# EAGLE design SJPL1 (EAGLE 7.7.0)
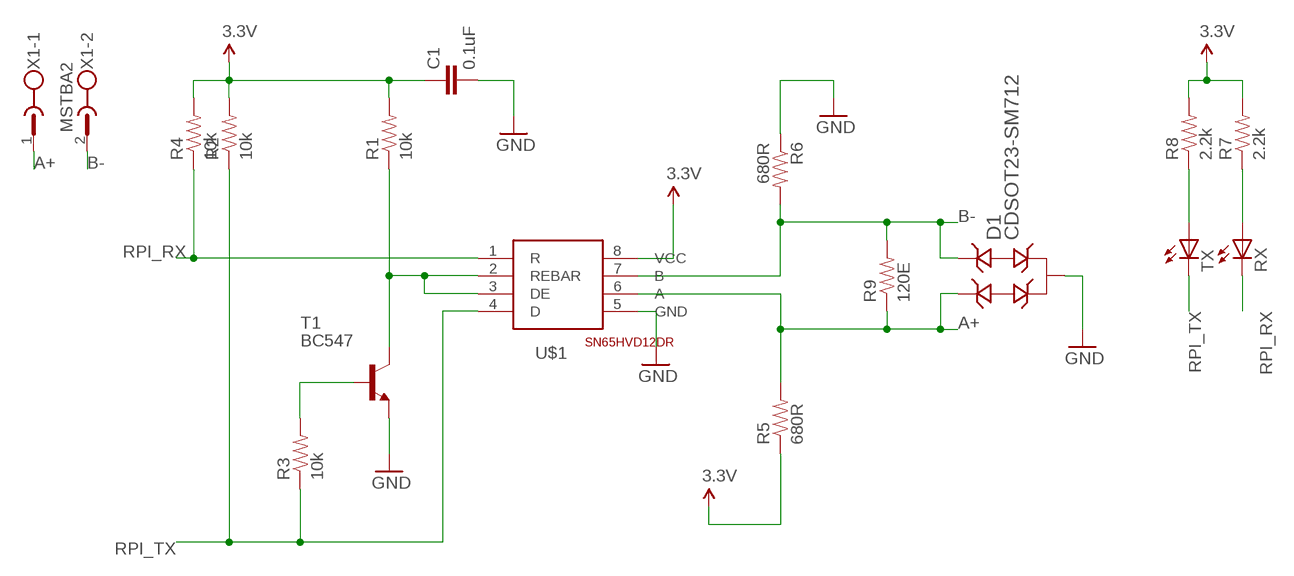
[diagram p0: schematic, sheet 1]

## Parts
C1  0.1uF  CAP0402-CAP  [0402-CAP]
D1  CDSOT23-SM712  [SOT-23-3]
R1  10k  RESISTOR0402  [0402-RES]
R2  10k  RESISTOR0402  [0402-RES]
R3  10k  RESISTOR0402  [0402-RES]
R4  10k  RESISTOR0402  [0402-RES]
R5  680R  RESISTOR0402  [0402-RES]
R6  680R  RESISTOR0402  [0402-RES]
R7  2.2k  RESISTOR0402  [0402-RES]
R8  2.2k  RESISTOR0402  [0402-RES]
R9  120E  RESISTOR0402  [0402-RES]
RX  LED5MM  [LED5MM]
T1  BC547  [TO92]
TX  LED5MM  [LED5MM]
U$1  MODBUS-DIP8MODBUSSO  [MODBUSS0]
X1  MSTBA2  [MSTBA2]

## Nets
A+: D1.1(IO1) R5.2 R9.1 X1.1
B-: D1.2(IO2) R6.2 R9.2 X1.2
GND: C1.2 D1.3(GND) R6.1
N$1: R8.1 TX.A
N$2: R7.1 RX.A
N$3: T1.1(E) ; supply symbol labelled GND
N$4: R1.1 T1.3(C) U$1.2(REBAR) U$1.3(DE)
N$5: R3.2 T1.2(B)
RPI_RX: R4.1 RX.K(C) U$1.1(R)
RPI_TX: R2.1 R3.1 TX.K(C) U$1.4(D)
VCC: C1.1 R1.2 R2.2 R4.2 R5.1 R7.2 R8.2 ; supply symbol labelled 3.3V
Unconnected: U$1.5(GND) U$1.6(A) U$1.7(B) U$1.8(VCC)

## Library data of the parts
C1 = SparkFun-Passives:CAP: Capacitor Standard 0603 ceramic capacitor, and 0.1" leaded capacitor.
D1 = CDSOT23-SM712:CDSOT23-SM712: Bourns CDSOT23-SM712 http://www.bourns.com/docs/Product-Datasheets/CDSOT23-SM712.pdf TVS Protection Didoe for RS-485 as recommended by TI in their RS-485 Reference Guide: http://www.ti.com/lit/sg/slyt484a/slyt484a.pdf; AVAILABILITY: Unavailable; DESCRIPTION: Diode, Smt Tvs Array, 7vrwm & 12vrwm, Sot23 Package; MF: Bourns; MP: CDSOT23-SM712; PACKAGE: SOT-23 Bourns; PRICE: None
R1-R9 = SparkFun-Resistors:RESISTOR: Resistor Basic schematic elements and footprints for 0603, 1206, and PTH resistors.
RX TX = led:LED: LED OSRAM: - CHIPLED LG R971, LG N971, LY N971, LG Q971, LY Q971, LO R971, LY R971 LH N974, LH R974 LS Q976, LO Q976, LY Q976 LO Q996 - Hyper CHIPLED LW Q18S LB Q993, LB Q99A, LB R99A - SideLED LS A670, LO A670, LY A670, LG A670, LP A670 LB A673, LV A673, LT A673, LW A673 LH A674 LY A675 LS A676, LA A676, LO A676, LY A676, LW A676 LS A679, LY A679, LG A679 - Hyper Micro SIDELED® LS Y876, LA Y876, LO Y876, LY Y876 LT Y87S - SmartLED LW L88C, LW L88S LB L89C, LB L89S, LG L890 LS L89K, LO L89K, LY L89K LS L896, LA L896, LO L896, LY L896 - TOPLED LS T670, LO T670, LY T670, LG T670, LP T670 LSG T670, LSP T670, LSY T670, LOP T670, LYG T670 LG T671, LOG T671, LSG T671 LB T673, LV T673, LT T673, LW T673 LH T674 LS T676, LA T676, LO T676, LY T676, LB T676, LH T676, LSB T676, LW T676 LB T67C, LV T67C, LT T67C, LS T67K, LO T67K, LY T67K, LW E67C LS E67B, LA E67B, LO E67B, LY E67B, LB E67C, LV E67C, LT E67C LW T67C LS T679, LY T679, LG T679 LS T770, LO T770, LY T770, LG T770, LP T770 LB T773, LV T773, LT T773, LW T773 LH T774 LS E675, LA E675, LY E675, LS T675 LS T776, LA T776, LO T776, LY T776, LB T776 LHGB T686 LT T68C, LB T68C - Hyper Mini TOPLED® LB M676 - Mini TOPLED Santana® LG M470 LS M47K, LO M47K, LY M47K Source: http://www.osram.convergy.de LUXEON: - LUMILED® LXK2-PW12-R00, LXK2-PW12-S00, LXK2-PW14-U00, LXK2-PW14-V00 LXK2-PM12-R00, LXK2-PM12-S00, LXK2-PM14-U00 LXK2-PE12-Q00, LXK2-PE12-R00, LXK2-PE12-S00, LXK2-PE14-T00, LXK2-PE14-U00 LXK2-PB12-K00, LXK2-PB12-L00, LXK2-PB12-M00, LXK2-PB14-N00, LXK2-PB14-P00, LXK2-PB14-Q00 LXK2-PR12-L00, LXK2-PR12-M00, LXK2-PR14-Q00, LXK2-PR14-R00 LXK2-PD12-Q00, LXK2-PD12-R00, LXK2-PD12-S00 LXK2-PH12-R00, LXK2-PH12-S00 LXK2-PL12-P00, LXK2-PL12-Q00, LXK2-PL12-R00 Source: www.luxeon.com KINGBRIGHT: KA-3528ASYC Source: www.kingbright.com
T1 = transistor-neu-to92:BC547: NPN TRANSISTOR
U$1 = modbus:MODBUS-DIP8
X1 = con-phoenix-508:MSTBA2: PHOENIX; MF: FARNELL; MPN: 1757242; OC_FARNELL: 3705171; OC_NEWARK: 71C4161

## Board
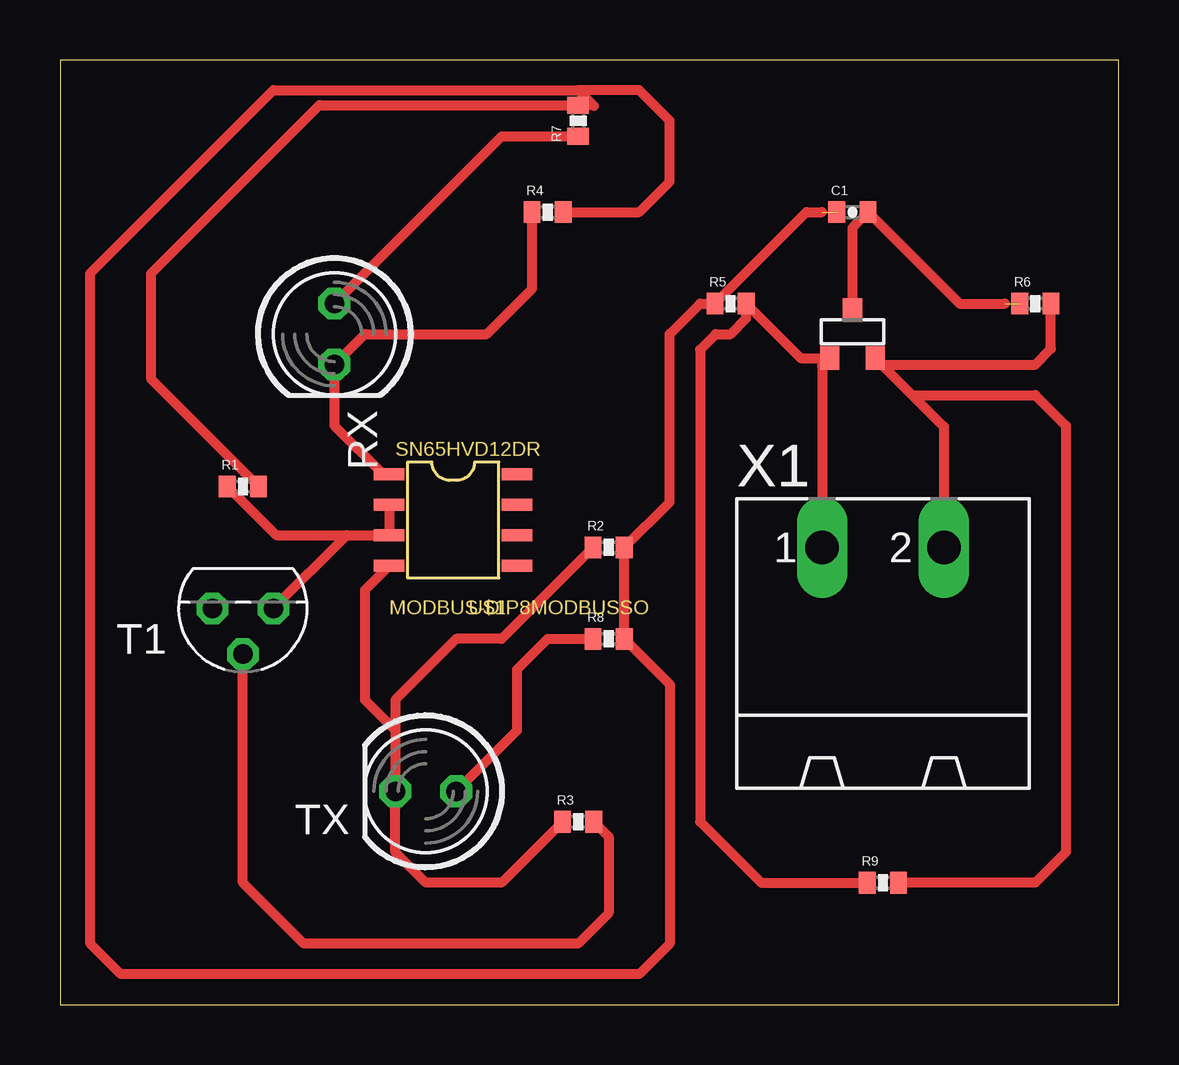
[diagram p1: board, top side]

Size 44.12 x 39.36 mm. Coordinates in mm from the lower left corner, seen from the top.
Outline: 0,0 44.12,0 44.12,39.36 0,39.36 0,0
Copper layers (1*16): Top 0.035mm / dielectric 1.5mm / Bottom 0.035mm
Design rules "default": minimum track width 10mil, minimum drill 24mil, track to track 8mil, track to pad 8mil, pad to pad 8mil, via to via 8mil, smd to smd 8mil, copper to edge 40mil, drill to drill 8mil, minimum pad ring 10mil, minimum via ring 8mil, stop-mask expansion 4mil, vias tented up to drill 0mil, thermal gap 10mil

### Footprints (pad centres in the part's own frame; a part is rotated, then mirrored left to right if it is on the bottom)
0402-CAP = smd 0.7 x 0.9: 1 -0.65,0; 2 0.65,0
SOT-23-3 = smd 0.802 x 0.972: 1 -0.95,-1; 2 0.95,-1; 3 0,1
0402-RES = smd 0.7 x 0.9: 1 -0.65,0; 2 0.65,0
LED5MM = drill 0.813 octagon: A -1.27,0; K 1.27,0
TO92 = drill 0.813 octagon: 1 1.27,0; 2 0,1.905; 3 -1.27,0
MODBUSS0 = smd 1.27 x 0.508: 1 -2.794,1.778; 2 -2.794,0.508; 3 -2.794,-0.762; 4 -2.794,-2.032; 5 2.54,-2.032; 6 2.54,-0.762; 7 2.54,0.508; 8 2.54,1.778
MSTBA2 = drill 1.397 long: 1 -2.54,5.08; 2 2.54,5.08

### Placement (x,y rotation side)
C1  33.02,33.02 0 top
D1  33.02,27.94 0 top
R1  7.62,21.59 0 top
R2  22.86,19.05 0 top
R3  21.59,7.62 0 top
R4  20.32,33.02 0 top
R5  27.94,29.21 0 top
R6  40.64,29.21 0 top
R7  21.59,36.83 90 top
R8  22.86,15.24 0 top
R9  34.29,5.08 0 top
RX  11.43,27.94 270 top
T1  7.62,16.51 180 top
TX  15.24,8.89 180 top
U$1  16.51,20.32 0 top
X1  34.29,13.97 0 top

### Tracks (layer width: path | path; a pad name or v marks a point on that pad's centre or on a via)
A+
  Top 0.406: X1.1 31.75,26.62 D1.1 30.86,26.94 R5.2 28.59,28.59 27.94,27.94 27.32,27.94 26.67,27.29 26.67,7.62 29.21,5.08 R9.1
B-
  Top 0.406: D1.2 35.51,25.4 40.64,25.4 41.91,24.13 41.91,6.35 40.64,5.08 R9.2 | D1.2 36.83,24.08 X1.2 | D1.2 34.24,26.67 40.64,26.67 41.29,27.32 R6.2
GND  (1 unrouted)
  Top 0.406: 39.37,29.21 37.48,29.21 C1.2 33.02,32.37 D1.3
N$1
  Top 0.406: TX.A 19.05,11.43 19.05,13.97 20.32,15.24 R8.1
N$2
  Top 0.406: RX.A 18.4,36.18 R7.1
N$4
  Top 0.406: T1.3 11.94,19.56 | 11.94,19.56 U$1.3 U$1.2 | R1.1 9,19.56 11.94,19.56
N$5
  Top 0.406: R3.2 22.86,7 22.86,3.81 21.59,2.54 10.16,2.54 7.62,5.08 T1.2
RPI_RX
  Top 0.406: U$1.1 13.46,22.1 11.43,24.13 RX.K 12.7,27.94 17.78,27.94 19.67,29.83 R4.1
RPI_TX
  Top 0.406: R3.1 18.4,5.08 15.24,5.08 13.97,6.35 TX.K 13.97,11.43 | U$1.4 12.7,17.27 12.7,12.7 13.97,11.43 | R2.1 18.4,15.24 16.51,15.24 13.97,12.7 13.97,11.43
VCC  (1 unrouted)
  Top 0.406: 31.75,33.02 31.1,33.02 R5.1 26.67,29.21 25.4,27.94 25.4,20.94 R2.2 R8.2 25.4,13.35 25.4,2.54 24.13,1.27 2.54,1.27 1.27,2.54 1.27,30.48 8.89,38.1 21.59,38.1 | 21.59,38.1 22.24,37.45 R7.2 10.81,37.48 3.81,30.48 3.81,26.05 R1.2 | R4.2 24.13,33.02 25.4,34.29 25.4,36.83 24.13,38.1 21.59,38.1